# EAGLE schematic batteryBalancer (EAGLE 8.4.0)
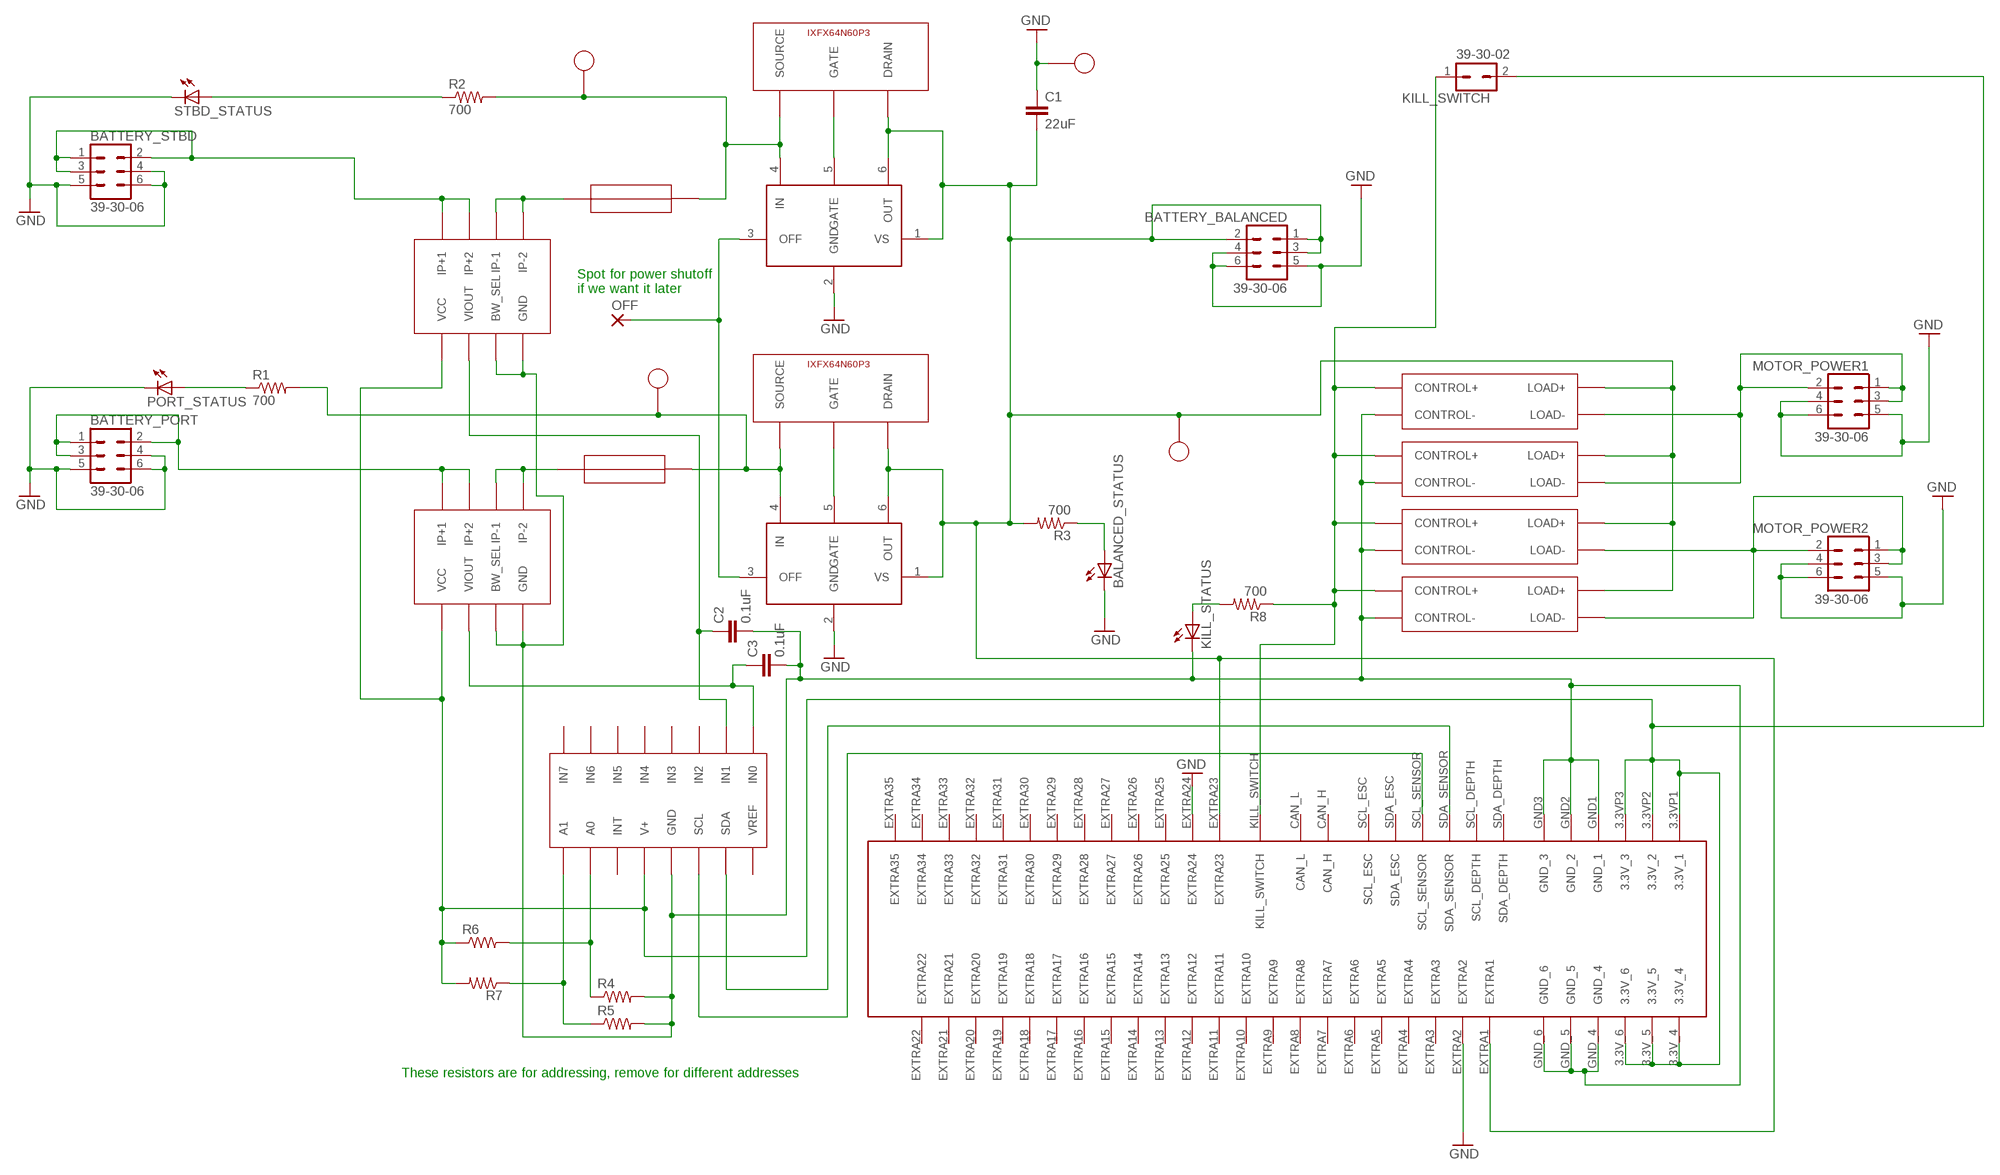
[diagram p0: schematic, sheet 1]

## Parts
ADC  ADC128D818  [TSSOP-16]
BALANCED_STATUS  LTST-S270GKT  [LTST-S270GKT]
BATTERY_BALANCED  39-30-06  [39-30-?06?]
BATTERY_PORT  39-30-06  [39-30-?06?]
BATTERY_STBD  39-30-06  [39-30-?06?]
C1  22uF  0.1UF-KIT-EZ-50V-20%  [CAP-PTH-SMALL-KIT]
C2  0.1uF  0.1UF-KIT-EZ-50V-20%  [CAP-PTH-SMALL-KIT]
C3  0.1uF  0.1UF-KIT-EZ-50V-20%  [CAP-PTH-SMALL-KIT]
EDGE_CONNECTOR  5530843  [5530843-6-BOARDFINGERS]
KILL_STATUS  LTST-S270GKT  [LTST-S270GKT]
KILL_SWITCH  39-30-02  [39-30-?02?]
MOTOR_POWER1  39-30-06  [39-30-?06?]
MOTOR_POWER2  39-30-06  [39-30-?06?]
OFF  2,54/1,1  [2,54/1,1]
PORT_CS  ACS722  [SOIC-8]
PORT_FC  LM5050-1  [SOT23-6]
PORT_FET  IXFX64N60P3  [IXFX64N60P3]
PORT_FUSE  01220083Z  [01220083Z]
PORT_STATUS  LTST-S270GKT  [LTST-S270GKT]
R1  700  R-US_0207/7  [0207/7]
R2  700  R-US_0207/7  [0207/7]
R3  700  R-US_0207/7  [0207/7]
R4  R-US_0204/5  [0204/5]
R5  R-US_0204/5  [0204/5]
R6  R-US_0204/5  [0204/5]
R7  R-US_0204/5  [0204/5]
R8  700  R-US_0207/7  [0207/7]
RELAY2  CMX60D20  [CMX60D20]
RELAY3  CMX60D20  [CMX60D20]
RELAY4  CMX60D20  [CMX60D20]
RLAY1  CMX60D20  [CMX60D20]
STBD_CS  ACS722  [SOIC-8]
STBD_FC  LM5050-1  [SOT23-6]
STBD_FET  IXFX64N60P3  [IXFX64N60P3]
STBD_FUSE  01220083Z  [01220083Z]
STBD_STATUS  LTST-S270GKT  [LTST-S270GKT]
U$1  5010_C  [5010_C]
U$2  5010_C  [5010_C]
U$3  5010_C  [5010_C]
U$4  5010_C  [5010_C]

## Nets
3.3V: ADC.V+ EDGE_CONNECTOR.3.3V_4 EDGE_CONNECTOR.3.3V_5 EDGE_CONNECTOR.3.3V_6 EDGE_CONNECTOR.3.3VP1(3.3V_1) EDGE_CONNECTOR.3.3VP2(3.3V_2) EDGE_CONNECTOR.3.3VP3(3.3V_3) KILL_SWITCH.2 PORT_CS.VCC R6.1 R7.2 STBD_CS.VCC
ADC_A0: ADC.A0 R4.1 R6.2
ADC_A1: ADC.A1 R5.1 R7.1
BALANCED_INDICATOR: BALANCED_STATUS.ANODE(A) R3.1
BALANCED_POWER: BATTERY_BALANCED.1 BATTERY_BALANCED.2 BATTERY_BALANCED.3 C1.2 EDGE_CONNECTOR.EXTRA1 EDGE_CONNECTOR.EXTRA23 PORT_FC.1(VS) PORT_FC.6(OUT) PORT_FET.DRAIN R3.2 RELAY2.LOAD+ RELAY3.LOAD+ RELAY4.LOAD+ RLAY1.LOAD+ STBD_FC.1(VS) STBD_FC.6(OUT) STBD_FET.DRAIN U$3.P$1
GND: BALANCED_STATUS.CATHODE(C) BATTERY_BALANCED.4 BATTERY_BALANCED.5 BATTERY_BALANCED.6 BATTERY_PORT.4 BATTERY_PORT.5 BATTERY_PORT.6 BATTERY_STBD.4 BATTERY_STBD.5 BATTERY_STBD.6 C1.1 EDGE_CONNECTOR.EXTRA2 EDGE_CONNECTOR.EXTRA24 MOTOR_POWER1.4 MOTOR_POWER1.5 MOTOR_POWER1.6 MOTOR_POWER2.4 MOTOR_POWER2.5 MOTOR_POWER2.6 PORT_FC.2(GND) PORT_STATUS.CATHODE(C) STBD_FC.2(GND) STBD_STATUS.CATHODE(C) U$4.P$1
KILL_SWITCH: EDGE_CONNECTOR.KILL_SWITCH KILL_SWITCH.1 R8.1 RELAY2.CONTROL+ RELAY3.CONTROL+ RELAY4.CONTROL+ RLAY1.CONTROL+
LOGIC_GND: ADC.GND C2.2 C3.2 EDGE_CONNECTOR.GND1(GND_1) EDGE_CONNECTOR.GND2(GND_2) EDGE_CONNECTOR.GND3(GND_3) EDGE_CONNECTOR.GND_4 EDGE_CONNECTOR.GND_5 EDGE_CONNECTOR.GND_6 KILL_STATUS.CATHODE(C) PORT_CS.BW_SEL PORT_CS.GND R4.2 R5.2 RELAY2.CONTROL- RELAY3.CONTROL- RELAY4.CONTROL- RLAY1.CONTROL- STBD_CS.BW_SEL STBD_CS.GND
MOTOR_POWER1: MOTOR_POWER1.1 MOTOR_POWER1.2 MOTOR_POWER1.3 RELAY2.LOAD- RLAY1.LOAD-
MOTOR_POWER2: MOTOR_POWER2.1 MOTOR_POWER2.2 MOTOR_POWER2.3 RELAY3.LOAD- RELAY4.LOAD-
N$2: STBD_CS.IP-1 STBD_CS.IP-2 STBD_FUSE.P$1 STBD_FUSE.P$2
N$3: KILL_STATUS.ANODE(A) R8.2
OFF: OFF.1(P) PORT_FC.3(OFF) STBD_FC.3(OFF)
PORT_CURRENT: ADC.IN0 C3.1 PORT_CS.VIOUT
PORT_GATE: PORT_FC.5(GATE) PORT_FET.GATE
PORT_POWER: BATTERY_PORT.1 BATTERY_PORT.2 BATTERY_PORT.3 PORT_CS.IP+1 PORT_CS.IP+2
PORT_SOURCE: PORT_FC.4(IN) PORT_FET.SOURCE PORT_FUSE.P$3 PORT_FUSE.P$4 R1.2 U$2.P$1
PORT_STATUS: PORT_STATUS.ANODE(A) R1.1
PORT_UNBALANCED: PORT_CS.IP-1 PORT_CS.IP-2 PORT_FUSE.P$1 PORT_FUSE.P$2
SCL: ADC.SCL EDGE_CONNECTOR.SCL_SENSOR
SDA: ADC.SDA EDGE_CONNECTOR.SDA_SENSOR
STBD_CURRENT: ADC.IN1 C2.1 STBD_CS.VIOUT
STBD_GATE: STBD_FC.5(GATE) STBD_FET.GATE
STBD_POWER: BATTERY_STBD.1 BATTERY_STBD.2 BATTERY_STBD.3 STBD_CS.IP+1 STBD_CS.IP+2
STBD_STATUS: R2.1 STBD_STATUS.ANODE(A)
STBD_UNBALANCED: R2.2 STBD_FC.4(IN) STBD_FET.SOURCE STBD_FUSE.P$3 STBD_FUSE.P$4 U$1.P$1
Unconnected: ADC.IN2 ADC.IN3 ADC.IN4 ADC.IN5 ADC.IN6 ADC.IN7 ADC.INT ADC.VREF EDGE_CONNECTOR.CAN_H EDGE_CONNECTOR.CAN_L EDGE_CONNECTOR.EXTRA3 EDGE_CONNECTOR.EXTRA4 EDGE_CONNECTOR.EXTRA5 EDGE_CONNECTOR.EXTRA6 EDGE_CONNECTOR.EXTRA7 EDGE_CONNECTOR.EXTRA8 EDGE_CONNECTOR.EXTRA9 EDGE_CONNECTOR.EXTRA10 EDGE_CONNECTOR.EXTRA11 EDGE_CONNECTOR.EXTRA12 EDGE_CONNECTOR.EXTRA13 EDGE_CONNECTOR.EXTRA14 EDGE_CONNECTOR.EXTRA15 EDGE_CONNECTOR.EXTRA16 EDGE_CONNECTOR.EXTRA17 EDGE_CONNECTOR.EXTRA18 EDGE_CONNECTOR.EXTRA19 EDGE_CONNECTOR.EXTRA20 EDGE_CONNECTOR.EXTRA21 EDGE_CONNECTOR.EXTRA22 EDGE_CONNECTOR.EXTRA25 EDGE_CONNECTOR.EXTRA26 EDGE_CONNECTOR.EXTRA27 EDGE_CONNECTOR.EXTRA28 EDGE_CONNECTOR.EXTRA29 EDGE_CONNECTOR.EXTRA30 EDGE_CONNECTOR.EXTRA31 EDGE_CONNECTOR.EXTRA32 EDGE_CONNECTOR.EXTRA33 EDGE_CONNECTOR.EXTRA34 EDGE_CONNECTOR.EXTRA35 EDGE_CONNECTOR.SCL_DEPTH EDGE_CONNECTOR.SCL_ESC EDGE_CONNECTOR.SDA_DEPTH EDGE_CONNECTOR.SDA_ESC

## Notes on the sheet
- Spot for power shutoff 
  if we want it later
- These resistors are for addressing, remove for different addresses

## Library data of the parts
ADC = ADC128D818:ADC128D818
BALANCED_STATUS KILL_STATUS PORT_STATUS STBD_STATUS = LTST-S270GKT:LTST-S270GKT
BATTERY_BALANCED BATTERY_PORT BATTERY_STBD MOTOR_POWER1 MOTOR_POWER2 = con-molex-mini-fit:39-30-?06?: HEADER
C1 = SparkFun-Capacitors:0.1UF: 0.1µF ceramic capacitors A capacitor is a passive two-terminal electrical component used to store electrical energy temporarily in an electric field.; PROD_ID: CAP-08370; VALUE: 0.1uF
C2 C3 = SparkFun-Capacitors:0.1UF: 0.1µF ceramic capacitors A capacitor is a passive two-terminal electrical component used to store electrical energy temporarily in an electric field.; PROD_ID: CAP-08370
EDGE_CONNECTOR = 5530843-6:5530843
KILL_SWITCH = con-molex-mini-fit:39-30-?02?: HEADER
OFF = wirepad:2,54/1,1: THROUGH-HOLE PAD
PORT_CS STBD_CS = ACS722:ACS722
PORT_FC STBD_FC = lio:LM5050-1
PORT_FET STBD_FET = IXFX64N60P3:IXFX64N60P3
PORT_FUSE STBD_FUSE = 01220083Z:01220083Z
R1-R3 R8 = rcl:R-US_: RESISTOR, American symbol
R4-R7 = resistor:R-US_: RESISTOR, American symbol
RELAY2-RELAY4 RLAY1 = CMX60D20:CMX60D20
U$1-U$4 = 5010_c:5010_C